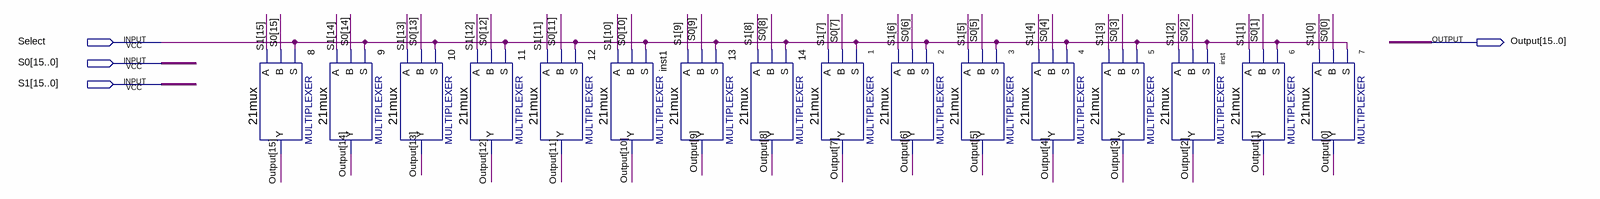
[diagram p0: schematic sheet]
// Quartus schematic Mux2to1_16bits.bdf as structural Verilog: 16 symbols, 4 pins
module Mux2to1_16bits (
  input  Select,
  input  [15:0] S0,
  input  [15:0] S1,
  output [15:0] Output
);

  \21mux  u_8 (.S(Select), .B(S0[15]), .A(S1[15]), .Y(Output[15]));
  \21mux  u_9 (.S(Select), .B(S0[14]), .A(S1[14]), .Y(Output[14]));
  \21mux  u_10 (.S(Select), .B(S0[13]), .A(S1[13]), .Y(Output[13]));
  \21mux  u_11 (.S(Select), .B(S0[12]), .A(S1[12]), .Y(Output[12]));
  \21mux  u_12 (.S(Select), .B(S0[11]), .A(S1[11]), .Y(Output[11]));
  \21mux  inst1 (.S(Select), .B(S0[10]), .A(S1[10]), .Y(Output[10]));
  \21mux  u_13 (.S(Select), .B(S0[9]), .A(S1[9]), .Y(Output[9]));
  \21mux  u_14 (.S(Select), .B(S0[8]), .A(S1[8]), .Y(Output[8]));
  \21mux  u_1 (.S(Select), .B(S0[7]), .A(S1[7]), .Y(Output[7]));
  \21mux  u_2 (.S(Select), .B(S0[6]), .A(S1[6]), .Y(Output[6]));
  \21mux  u_3 (.S(Select), .B(S0[5]), .A(S1[5]), .Y(Output[5]));
  \21mux  u_4 (.S(Select), .B(S0[4]), .A(S1[4]), .Y(Output[4]));
  \21mux  u_5 (.S(Select), .B(S0[3]), .A(S1[3]), .Y(Output[3]));
  \21mux  inst (.S(Select), .B(S0[2]), .A(S1[2]), .Y(Output[2]));
  \21mux  u_6 (.S(Select), .B(S0[1]), .A(S1[1]), .Y(Output[1]));
  \21mux  u_7 (.S(Select), .B(S0[0]), .A(S1[0]), .Y(Output[0]));
endmodule
